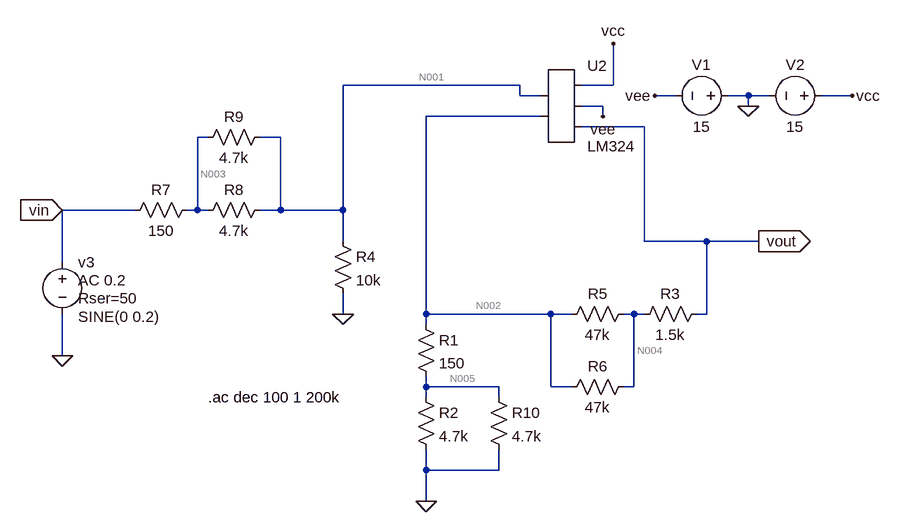
[diagram p0: schematic ej1_circ2_caso1.asc]
* ej1_circ2_caso1.asc
R3 vout N004 1.5k
R4 N001 0 10k
V1 0 vee 15
V2 vcc 0 15
R5 N004 N002 47k
R6 N004 N002 47k
v3 vin 0 SINE(0 0.2) AC 0.2 Rser=50
R7 vin N003 150
R8 N003 N001 4.7k
R9 N003 N001 4.7k
R1 N002 N005 150
R2 N005 0 4.7k
R10 N005 0 4.7k
* U2: LM324 (symbol AutoGenerated\LM324 not available, pins judged from their places): pin1=N001 pin2=N002 pin3=vcc pin4=vee pin5=vout
.ac dec 100 1 200k
.backanno
.end

* Results of the author's LTspice run, read from the files saved beside the schematic
* Operating Point, zero values left out:
*   V(vout) = -423.4 µV
*   V(n004) = -397.6 µV
*   V(n001) = 40.47 µV
*   V(vee) = -15 V
*   V(vcc) = 15 V
*   V(n002) = 6.816 µV
*   V(vin) = 793.5 nV
*   V(n003) = 3.174 µV
*   V(n005) = 6.407 µV
*   I(R10) = 1.363 nA
*   I(R2) = 1.363 nA
*   I(R1) = 2.726 nA
*   I(R9) = -7.935 nA
*   I(R8) = -7.935 nA
*   I(R7) = -15.87 nA
*   I(R6) = -8.604 nA
*   I(R5) = -8.604 nA
*   I(R4) = 4.047 nA
*   I(R3) = -17.21 nA
*   I(V3) = 15.87 nA
*   I(V2) = -999.8 µA
*   I(V1) = -999.7 µA
*   Ix(u2:1) = -19.92 nA
*   Ix(u2:2) = -19.93 nA
*   Ix(u2:3) = 999.8 µA
*   Ix(u2:4) = -999.7 µA
*   Ix(u2:5) = 17.21 nA
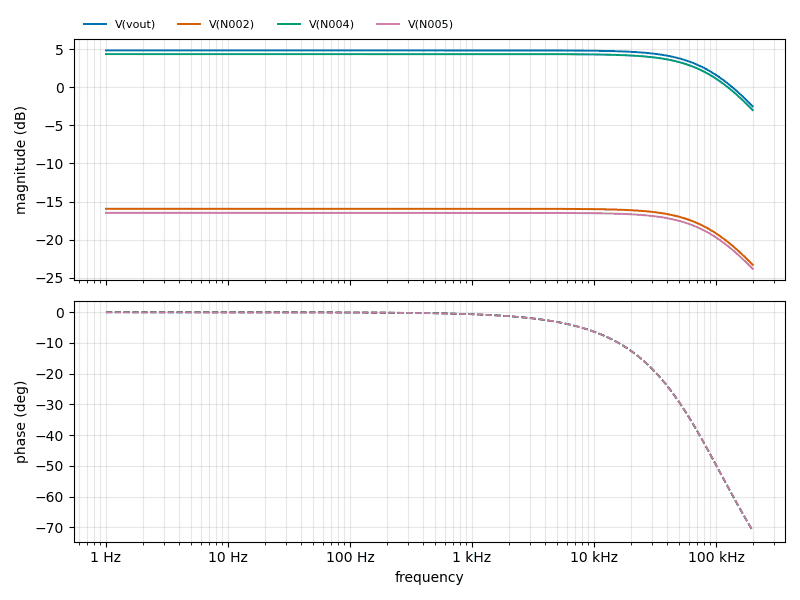
[diagram p1: AC Analysis of ej1_circ2_caso1.asc, plotted from the saved traces]
* AC Analysis, 1 run:
*   V(vout): 4.87 dB at 1 Hz, -2.49 dB at 200 kHz, peak 4.87 dB at 1 Hz, 3 dB below the peak at 95.26 kHz
*   V(N002): -15.95 dB at 1 Hz, -23.32 dB at 200 kHz, peak -15.95 dB at 1 Hz, 3 dB below the peak at 95.25 kHz
*   V(N004): 4.39 dB at 1 Hz, -2.98 dB at 200 kHz, peak 4.39 dB at 1 Hz, 3 dB below the peak at 95.26 kHz
*   V(N005): -16.49 dB at 1 Hz, -23.86 dB at 200 kHz, peak -16.49 dB at 1 Hz, 3 dB below the peak at 95.25 kHz